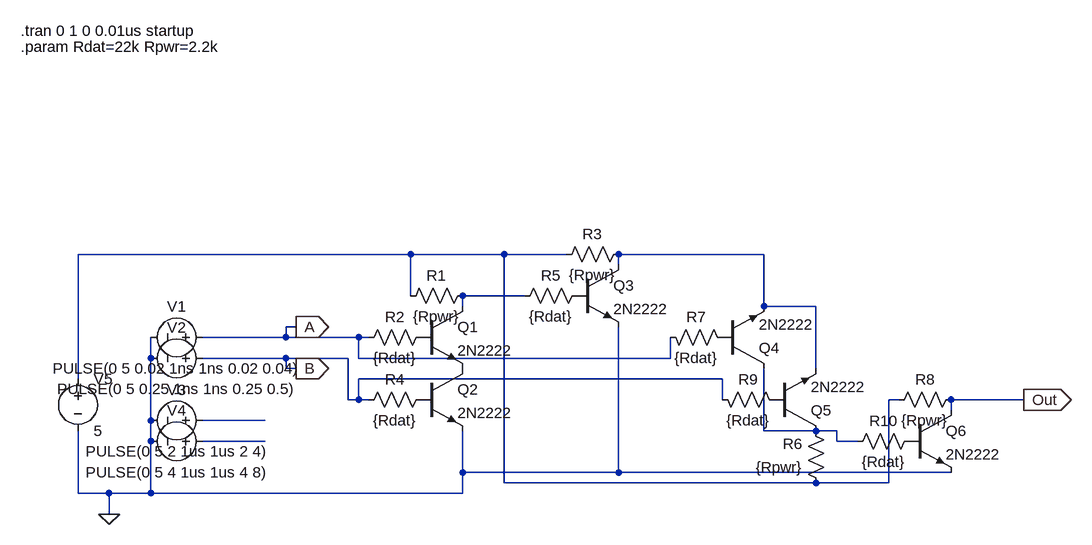
[diagram p0: schematic 2Adder.asc]
2Adder.asc, the LTspice schematic file:
Version 4.1
SHEET 1 1252 680
WIRE 208 144 -304 144
WIRE 352 144 208 144
WIRE 448 144 352 144
WIRE 752 144 528 144
WIRE 528 160 528 144
WIRE 208 208 208 144
WIRE 384 208 288 208
WIRE 288 224 288 208
WIRE 752 224 752 144
WIRE 832 224 752 224
WIRE 32 256 16 256
WIRE 16 272 16 256
WIRE 16 272 -112 272
WIRE 128 272 16 272
WIRE 144 272 128 272
WIRE -192 304 -192 272
WIRE 16 304 -112 304
WIRE 112 304 16 304
WIRE 128 304 128 272
WIRE 608 304 608 272
WIRE 608 304 128 304
WIRE 16 320 16 304
WIRE 32 320 16 320
WIRE 832 320 832 224
WIRE -304 336 -304 144
WIRE 688 336 128 336
WIRE 112 368 112 304
WIRE 128 368 128 336
WIRE 128 368 112 368
WIRE 144 368 128 368
WIRE 688 368 688 336
WIRE 960 368 944 368
WIRE 1152 368 1040 368
WIRE 1040 384 1040 368
WIRE -192 400 -192 304
WIRE -16 400 -112 400
WIRE 752 416 752 320
WIRE 832 416 752 416
WIRE 864 416 832 416
WIRE -192 432 -192 400
WIRE -16 432 -112 432
WIRE 864 432 864 416
WIRE 896 432 864 432
WIRE 288 480 288 416
WIRE 528 480 528 256
WIRE 528 480 288 480
WIRE 1040 480 528 480
WIRE 352 496 352 144
WIRE 832 496 352 496
WIRE 944 496 944 368
WIRE 944 496 832 496
WIRE -304 512 -304 416
WIRE -256 512 -304 512
WIRE -192 512 -192 432
WIRE -192 512 -256 512
WIRE 288 512 288 480
WIRE 288 512 -192 512
WIRE -256 544 -256 512
FLAG -256 544 0
FLAG 32 256 A
IOPIN 32 256 Out
FLAG 32 320 B
IOPIN 32 320 Out
FLAG 1152 368 Out
IOPIN 1152 368 Out
SYMBOL voltage -96 272 R90
WINDOW 0 -32 56 VBottom 2
WINDOW 3 32 56 VTop 2
WINDOW 123 0 0 Left 0
WINDOW 39 0 0 Left 0
SYMATTR InstName V1
SYMATTR Value PULSE(0 5 0.02 1ns 1ns 0.02 0.04)
SYMBOL voltage -96 304 R90
WINDOW 0 -32 56 VBottom 2
WINDOW 3 32 56 VTop 2
WINDOW 123 0 0 Left 0
WINDOW 39 0 0 Left 0
SYMATTR InstName V2
SYMATTR Value PULSE(0 5 0.25 1ns 1ns 0.25 0.5)
SYMBOL voltage -96 400 R90
WINDOW 0 -32 56 VBottom 2
WINDOW 3 32 56 VTop 2
WINDOW 123 0 0 Left 0
WINDOW 39 0 0 Left 0
SYMATTR InstName V3
SYMATTR Value PULSE(0 5 2 1us 1us 2 4)
SYMBOL voltage -96 432 R90
WINDOW 0 -32 56 VBottom 2
WINDOW 3 32 56 VTop 2
WINDOW 123 0 0 Left 0
WINDOW 39 0 0 Left 0
SYMATTR InstName V4
SYMATTR Value PULSE(0 5 4 1us 1us 4 8)
SYMBOL voltage -304 320 R0
WINDOW 123 0 0 Left 0
WINDOW 39 0 0 Left 0
SYMATTR InstName V5
SYMATTR Value 5
SYMBOL npn 224 224 R0
SYMATTR InstName Q1
SYMATTR Value 2N2222
SYMBOL res 192 224 R270
WINDOW 0 32 56 VTop 2
WINDOW 3 0 56 VBottom 2
SYMATTR InstName R1
SYMATTR Value {Rpwr}
SYMBOL res 128 288 R270
WINDOW 0 32 56 VTop 2
WINDOW 3 0 56 VBottom 2
SYMATTR InstName R2
SYMATTR Value {Rdat}
SYMBOL npn 224 320 R0
SYMATTR InstName Q2
SYMATTR Value 2N2222
SYMBOL res 128 384 R270
WINDOW 0 32 56 VTop 2
WINDOW 3 0 56 VBottom 2
SYMATTR InstName R4
SYMATTR Value {Rdat}
SYMBOL npn 464 160 R0
SYMATTR InstName Q3
SYMATTR Value 2N2222
SYMBOL res 432 160 R270
WINDOW 0 32 56 VTop 2
WINDOW 3 0 56 VBottom 2
SYMATTR InstName R3
SYMATTR Value {Rpwr}
SYMBOL res 368 224 R270
WINDOW 0 32 56 VTop 2
WINDOW 3 0 56 VBottom 2
SYMATTR InstName R5
SYMATTR Value {Rdat}
SYMBOL npn 688 320 M180
SYMATTR InstName Q4
SYMATTR Value 2N2222
SYMBOL res 848 512 R180
WINDOW 0 36 76 Left 2
WINDOW 3 36 40 Left 2
SYMATTR InstName R6
SYMATTR Value {Rpwr}
SYMBOL res 592 256 M90
WINDOW 0 0 56 VBottom 2
WINDOW 3 32 56 VTop 2
SYMATTR InstName R7
SYMATTR Value {Rdat}
SYMBOL npn 768 416 M180
SYMATTR InstName Q5
SYMATTR Value 2N2222
SYMBOL res 672 352 M90
WINDOW 0 0 56 VBottom 2
WINDOW 3 32 56 VTop 2
SYMATTR InstName R9
SYMATTR Value {Rdat}
SYMBOL npn 976 384 R0
SYMATTR InstName Q6
SYMATTR Value 2N2222
SYMBOL res 944 384 R270
WINDOW 0 32 56 VTop 2
WINDOW 3 0 56 VBottom 2
SYMATTR InstName R8
SYMATTR Value {Rpwr}
SYMBOL res 880 448 R270
WINDOW 0 32 56 VTop 2
WINDOW 3 0 56 VBottom 2
SYMATTR InstName R10
SYMATTR Value {Rdat}
TEXT -392 -176 Left 2 !.param Rdat=22k Rpwr=2.2k
TEXT -392 -200 Left 2 !.tran 0 1 0 0.01us startup

The netlist it stands for:
* 2Adder.asc
V1 A 0 PULSE(0 5 0.02 1ns 1ns 0.02 0.04)
V2 B 0 PULSE(0 5 0.25 1ns 1ns 0.25 0.5)
V3 N004 0 PULSE(0 5 2 1us 1us 2 4)
V4 N006 0 PULSE(0 5 4 1us 1us 4 8)
V5 N001 0 5
Q1 N003 P001 P002 0 2N2222
R1 N001 N003 {Rpwr}
R2 A P001 {Rdat}
Q2 P002 P003 0 0 2N2222
R4 B P003 {Rdat}
Q3 N002 P004 0 0 2N2222
R3 N001 N002 {Rpwr}
R5 N003 P004 {Rdat}
Q4 N005 P005 N002 0 2N2222
R6 N001 N005 {Rpwr}
R7 A P005 {Rdat}
Q5 N005 P006 N002 0 2N2222
R9 B P006 {Rdat}
Q6 Out P007 0 0 2N2222
R8 N001 Out {Rpwr}
R10 N005 P007 {Rdat}
.model NPN NPN
.model PNP PNP
.lib standard.bjt
.param Rdat=22k Rpwr=2.2k
.tran 0 1 0 0.01us startup
.backanno
.end